# EAGLE schematic Robot (EAGLE 7.6.0)
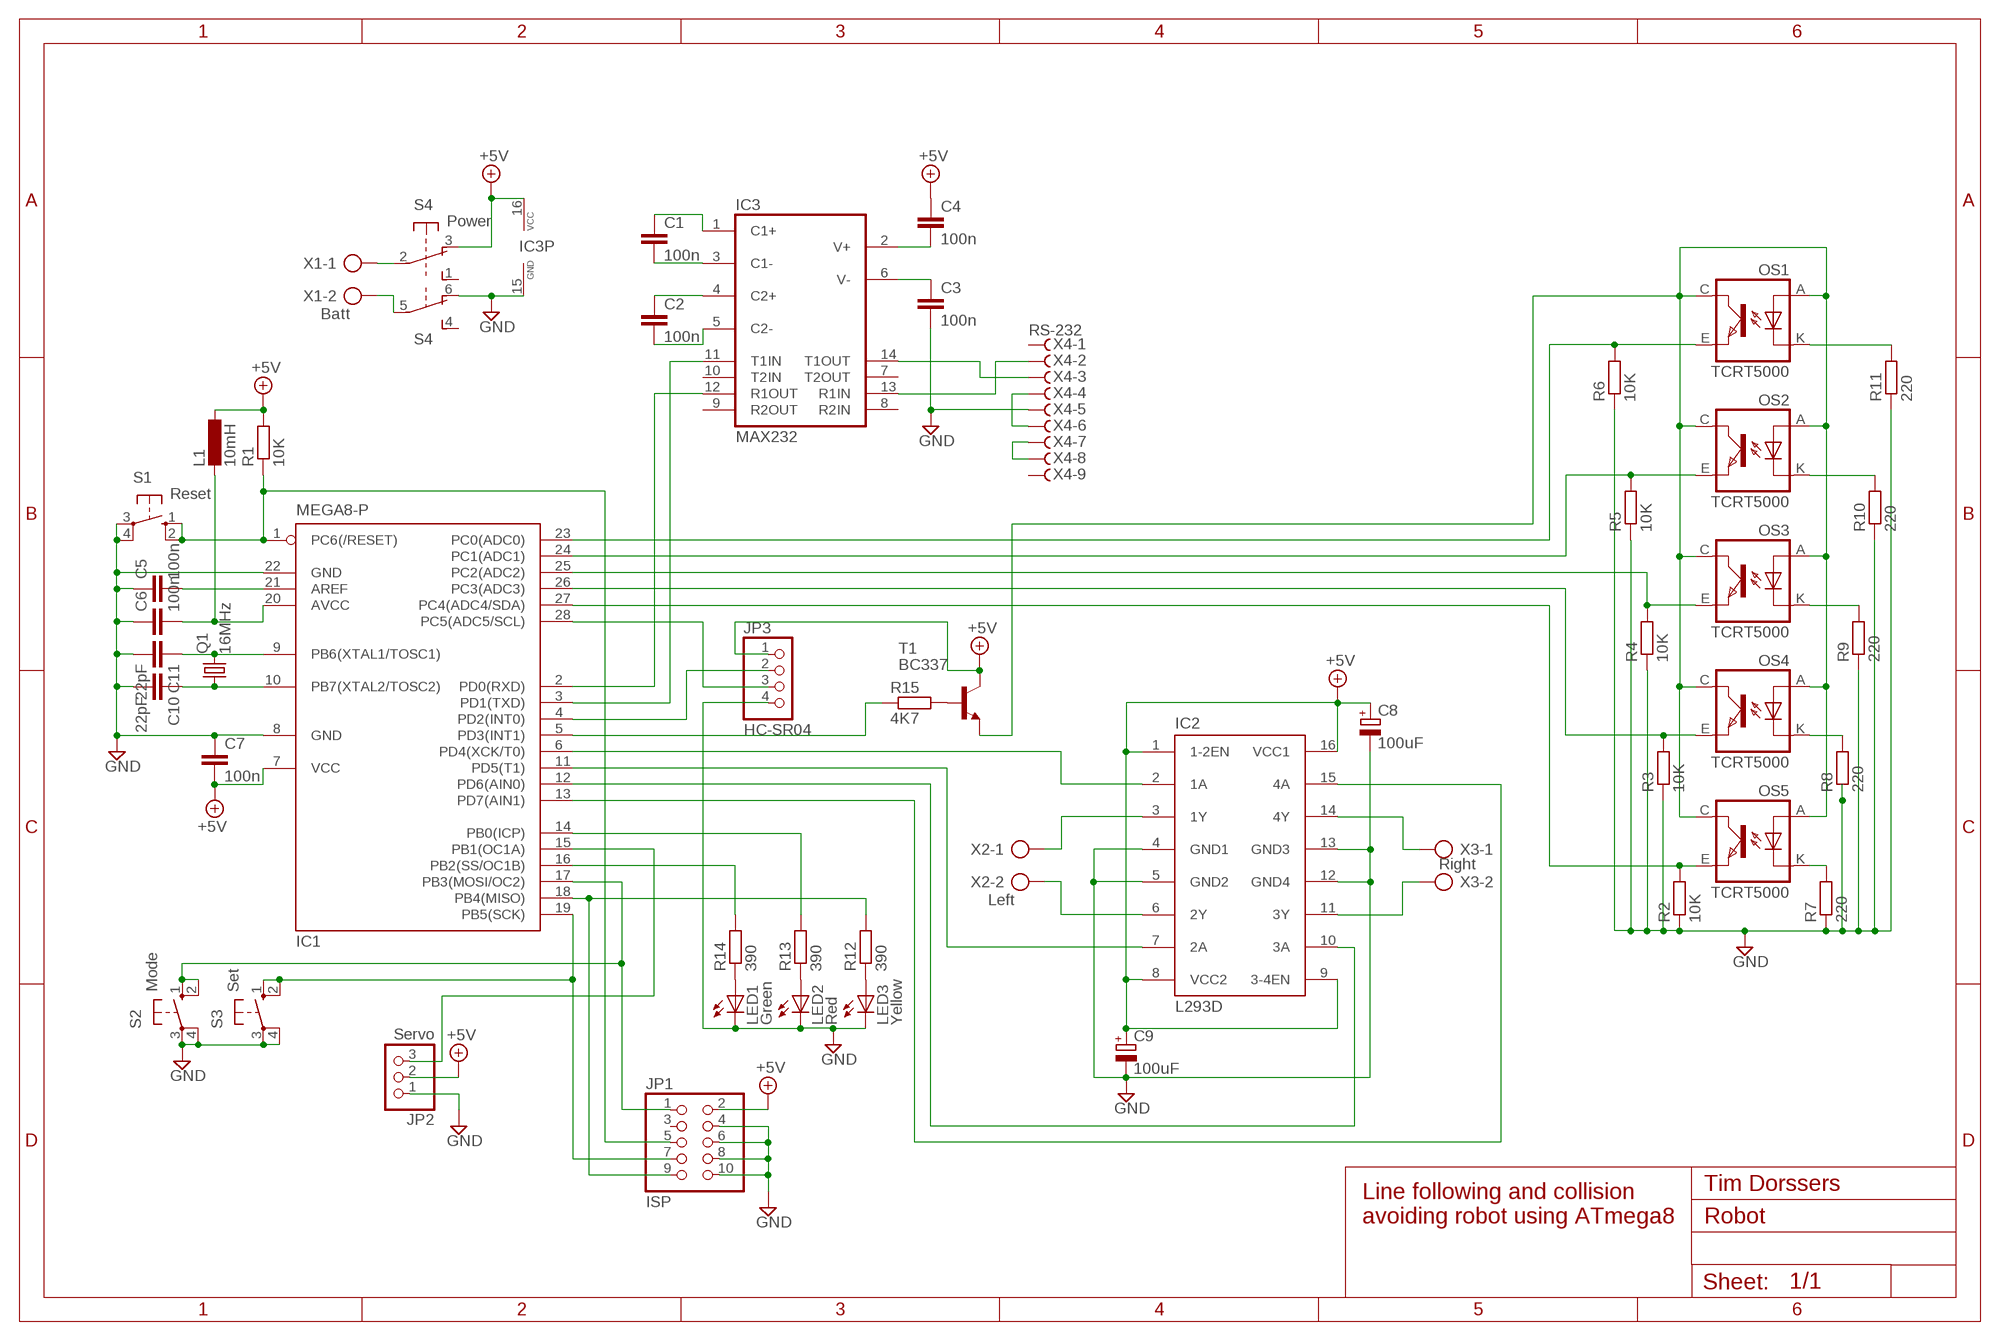
[diagram p0: schematic, sheet 1]

## Parts
C1  100n  C-EU025-025X050  [C025-025X050]
C2  100n  C-EU025-025X050  [C025-025X050]
C3  100n  C-EU025-025X050  [C025-025X050]
C4  100n  C-EU025-025X050  [C025-025X050]
C5  100n  C-EU025-025X050  [C025-025X050]
C6  100n  C-EU025-025X050  [C025-025X050]
C7  100n  C-EU025-025X050  [C025-025X050]
C8  100uF  CPOL-EUB45181A  [B45181A]
C9  100uF  CPOL-EUB45181A  [B45181A]
C10  22pF  C-EU025-024X044  [C025-024X044]
C11  22pF  C-EU025-024X044  [C025-024X044]
IC1  MEGA8-P  [DIL28-3]
IC2  L293D  [DIL16]
IC3  MAX232  [DIL16]
JP1  ISP  PINHD-2X5  [2X05]
JP2  Servo  PINHD-1X3  [1X03]
JP3  HC-SR04  PINHD-1X4  [1X04]
L1  10mH  L-EU0207/10  [0207/10]
LED1  Green  LED5MM  [LED5MM]
LED2  Red  LED5MM  [LED5MM]
LED3  Yellow  LED5MM  [LED5MM]
OS1  TCRT5000  [TCRT5000]
OS2  TCRT5000  [TCRT5000]
OS3  TCRT5000  [TCRT5000]
OS4  TCRT5000  [TCRT5000]
OS5  TCRT5000  [TCRT5000]
Q1  16MHz  CRYSTALHC49U-V  [HC49U-V]
R1  10K  R-EU_0204/7  [0204/7]
R2  10K  R-EU_0204/7  [0204/7]
R3  10K  R-EU_0204/7  [0204/7]
R4  10K  R-EU_0204/7  [0204/7]
R5  10K  R-EU_0204/7  [0204/7]
R6  10K  R-EU_0204/7  [0204/7]
R7  220  R-EU_0204/7  [0204/7]
R8  220  R-EU_0204/7  [0204/7]
R9  220  R-EU_0204/7  [0204/7]
R10  220  R-EU_0204/7  [0204/7]
R11  220  R-EU_0204/7  [0204/7]
R12  390  R-EU_0204/7  [0204/7]
R13  390  R-EU_0204/7  [0204/7]
R14  390  R-EU_0204/7  [0204/7]
R15  4K7  R-EU_0204/7  [0204/7]
S1  Reset  10-XX  [B3F-10XX]
S2  Mode  10-XX  [B3F-10XX]
S3  Set  10-XX  [B3F-10XX]
S4  Power  PVA2  [PVA2F]
T1  BC337  [TO92]
X1  Batt  AK300/2  [AK300/2]
X2  Left  AK300/2  [AK300/2]
X3  Right  AK300/2  [AK300/2]
X4  RS-232  D-SUB9-H3M09RA  [H3M09RA]

## Nets
+5V: C4.1 C7.2 C8.+ C9.+ IC1.7(VCC) IC2.1(1-2EN) IC2.8(VCC2) IC2.9(3-4EN) IC2.16(VCC1) IC3.16(VCC) JP1.2 JP2.2 JP3.1 L1.1 R1.2 S4.3(1:O) T1.3(C)
GND: C3.2 C5.1 C6.1 C7.1 C8.- C9.- C10.2 C11.2 IC1.8(GND) IC1.22(GND) IC2.4(GND1) IC2.5(GND2) IC2.12(GND4) IC2.13(GND3) IC3.15(GND) JP1.4 JP1.6 JP1.8 JP1.10 JP2.1 JP3.4 LED1.K(C) LED2.K(C) LED3.K(C) R2.1 R3.1 R4.1 R5.1 R6.1 R7.1 R8.1 R9.1 R10.1 R11.1 S1.3(P) S1.4(P1) S2.3(P) S2.4(P1) S3.3(P) S3.4(P1) S4.6(2:O) X4.5
N$1: LED3.A R12.1
N$2: IC1.23(PC0(ADC0)) OS1.E(EMITTER) R6.2
N$3: IC1.24(PC1(ADC1)) OS2.E(EMITTER) R5.2
N$4: IC1.25(PC2(ADC2)) OS3.E(EMITTER) R4.2
N$5: IC1.26(PC3(ADC3)) OS4.E(EMITTER) R3.2
N$6: IC1.27(PC4(ADC4/SDA)) OS5.E(EMITTER) R2.2
N$7: OS5.K(CATHODE) R7.2
N$8: OS1.K(CATHODE) R11.2
N$9: OS2.K(CATHODE) R10.2
N$10: OS3.K(CATHODE) R9.2
N$11: OS4.K(CATHODE) R8.2
N$12: S4.5(2:P) X1.2
N$13: C4.2 IC3.2(V+)
N$14: C3.1 IC3.6(V-)
N$15: C1.1 IC3.1(C1+)
N$16: C1.2 IC3.3(C1-)
N$17: C2.1 IC3.4(C2+)
N$18: C2.2 IC3.5(C2-)
N$19: IC1.1(PC6(/RESET)) JP1.5 R1.1 S1.1(S) S1.2(S1)
N$20: C11.1 IC1.9(PB6(XTAL1/TOSC1)) Q1.2
N$21: C10.1 IC1.10(PB7(XTAL2/TOSC2)) Q1.1
N$22: C5.2 IC1.21(AREF)
N$23: C6.2 IC1.20(AVCC) L1.2
N$24: S4.2(1:P) X1.1
N$25: IC1.2(PD0(RXD)) IC3.12(R1OUT)
N$26: IC1.3(PD1(TXD)) IC3.11(T1IN)
N$27: IC1.4(PD2(INT0)) JP3.2
N$28: IC1.6(PD4(XCK/T0)) IC2.2(1A)
N$29: IC1.11(PD5(T1)) IC2.7(2A)
N$30: IC1.12(PD6(AIN0)) IC2.10(3A)
N$31: IC2.3(1Y) X2.1
N$32: IC2.6(2Y) X2.2
N$33: IC2.14(4Y) X3.1
N$34: IC2.11(3Y) X3.2
N$35: IC1.13(PD7(AIN1)) IC2.15(4A)
N$36: IC1.28(PC5(ADC5/SCL)) JP3.3
N$37: LED1.A R14.1
N$38: IC1.15(PB1(OC1A)) JP2.3
N$39: X4.7 X4.8
N$40: X4.4 X4.6
N$41: IC3.13(R1IN) X4.2
N$42: IC3.14(T1OUT) X4.3
N$43: LED2.A R13.1
N$44: IC1.17(PB3(MOSI/OC2)) JP1.1 S2.1(S) S2.2(S1)
N$45: IC1.5(PD3(INT1)) R15.1
N$46: IC1.16(PB2(SS/OC1B)) R14.2
N$47: IC1.14(PB0(ICP)) R13.2
N$48: R15.2 T1.2(B)
N$50: OS1.A(ANODE) OS1.C(COLLECTOR) OS2.A(ANODE) OS2.C(COLLECTOR) OS3.A(ANODE) OS3.C(COLLECTOR) OS4.A(ANODE) OS4.C(COLLECTOR) OS5.A(ANODE) OS5.C(COLLECTOR) T1.1(E)
N$52: IC1.19(PB5(SCK)) JP1.7 S3.1(S) S3.2(S1)
N$53: IC1.18(PB4(MISO)) JP1.9 R12.2
Unconnected: IC3.7(T2OUT) IC3.8(R2IN) IC3.9(R2OUT) IC3.10(T2IN) JP1.3 S4.1(1:S) S4.4(2:S) X4.1 X4.9

## Notes on the sheet
- Tim Dorssers
- Line following and collision 
  avoiding robot using ATmega8

## Library data of the parts
C1-C7 C10 C11 = rcl:C-EU: CAPACITOR, European symbol
C8 C9 = rcl:CPOL-EU: POLARIZED CAPACITOR, European symbol
IC1 = atmel:MEGA8-P: MICROCONTROLLER 8 Kbytes FLASH, 1 kbytes SRAM, 512 bytes EEPROM, USART, 4-channel 10 bit ADC, 2-channel 8 bit ADC Pin compatible with Atmega48, ATMega88, ATMega168 Source: avr.lbr
IC2 = st-microelectronics:L293D: PUSH-PULL 4 CHANNEL DRIVER
IC3 = maxim:MAX232: RS232 TRANSEIVER
JP1 = pinhead:PINHD-2X5: PIN HEADER
JP2 = pinhead:PINHD-1X3: PIN HEADER
JP3 = pinhead:PINHD-1X4: PIN HEADER
L1 = rcl:L-EU: INDUCTOR, European symbol
LED1-LED3 = led:LED: LED OSRAM: - CHIPLED LG R971, LG N971, LY N971, LG Q971, LY Q971, LO R971, LY R971 LH N974, LH R974 LS Q976, LO Q976, LY Q976 LO Q996 - Hyper CHIPLED LW Q18S LB Q993, LB Q99A, LB R99A - SideLED LS A670, LO A670, LY A670, LG A670, LP A670 LB A673, LV A673, LT A673, LW A673 LH A674 LY A675 LS A676, LA A676, LO A676, LY A676, LW A676 LS A679, LY A679, LG A679 - Hyper Micro SIDELED® LS Y876, LA Y876, LO Y876, LY Y876 LT Y87S - SmartLED LW L88C, LW L88S LB L89C, LB L89S, LG L890 LS L89K, LO L89K, LY L89K LS L896, LA L896, LO L896, LY L896 - TOPLED LS T670, LO T670, LY T670, LG T670, LP T670 LSG T670, LSP T670, LSY T670, LOP T670, LYG T670 LG T671, LOG T671, LSG T671 LB T673, LV T673, LT T673, LW T673 LH T674 LS T676, LA T676, LO T676, LY T676, LB T676, LH T676, LSB T676, LW T676 LB T67C, LV T67C, LT T67C, LS T67K, LO T67K, LY T67K, LW E67C LS E67B, LA E67B, LO E67B, LY E67B, LB E67C, LV E67C, LT E67C LW T67C LS T679, LY T679, LG T679 LS T770, LO T770, LY T770, LG T770, LP T770 LB T773, LV T773, LT T773, LW T773 LH T774 LS E675, LA E675, LY E675, LS T675 LS T776, LA T776, LO T776, LY T776, LB T776 LHGB T686 LT T68C, LB T68C - Hyper Mini TOPLED® LB M676 - Mini TOPLED Santana® LG M470 LS M47K, LO M47K, LY M47K Source: http://www.osram.convergy.de LUXEON: - LUMILED® LXK2-PW12-R00, LXK2-PW12-S00, LXK2-PW14-U00, LXK2-PW14-V00 LXK2-PM12-R00, LXK2-PM12-S00, LXK2-PM14-U00 LXK2-PE12-Q00, LXK2-PE12-R00, LXK2-PE12-S00, LXK2-PE14-T00, LXK2-PE14-U00 LXK2-PB12-K00, LXK2-PB12-L00, LXK2-PB12-M00, LXK2-PB14-N00, LXK2-PB14-P00, LXK2-PB14-Q00 LXK2-PR12-L00, LXK2-PR12-M00, LXK2-PR14-Q00, LXK2-PR14-R00 LXK2-PD12-Q00, LXK2-PD12-R00, LXK2-PD12-S00 LXK2-PH12-R00, LXK2-PH12-S00 LXK2-PL12-P00, LXK2-PL12-Q00, LXK2-PL12-R00 Source: www.luxeon.com KINGBRIGHT: KA-3528ASYC Source: www.kingbright.com
OS1-OS5 = tcrt5000:TCRT5000
Q1 = crystal:CRYSTAL: CRYSTAL
R1-R15 = resistor:R-EU_: RESISTOR, European symbol
S1-S3 = switch-omron:10-XX: OMRON SWITCH; MPN: B3F-1000; OC_FARNELL: 176432; OC_NEWARK: 36M3542
S4 = switch-misc:PVA2: ITT SWITCH
T1 = transistor:BC337: NPN TRANSISTOR
X1-X3 = con-ptr500:AK300/2: CONNECTOR
X4 = con-thomas-betts:D-SUB9-: D-Subminiatur Connector Source: Electronioc Interconnects European Edition 1998